# EAGLE schematic DC-DC Converter Module V2 (EAGLE 9.2.2)
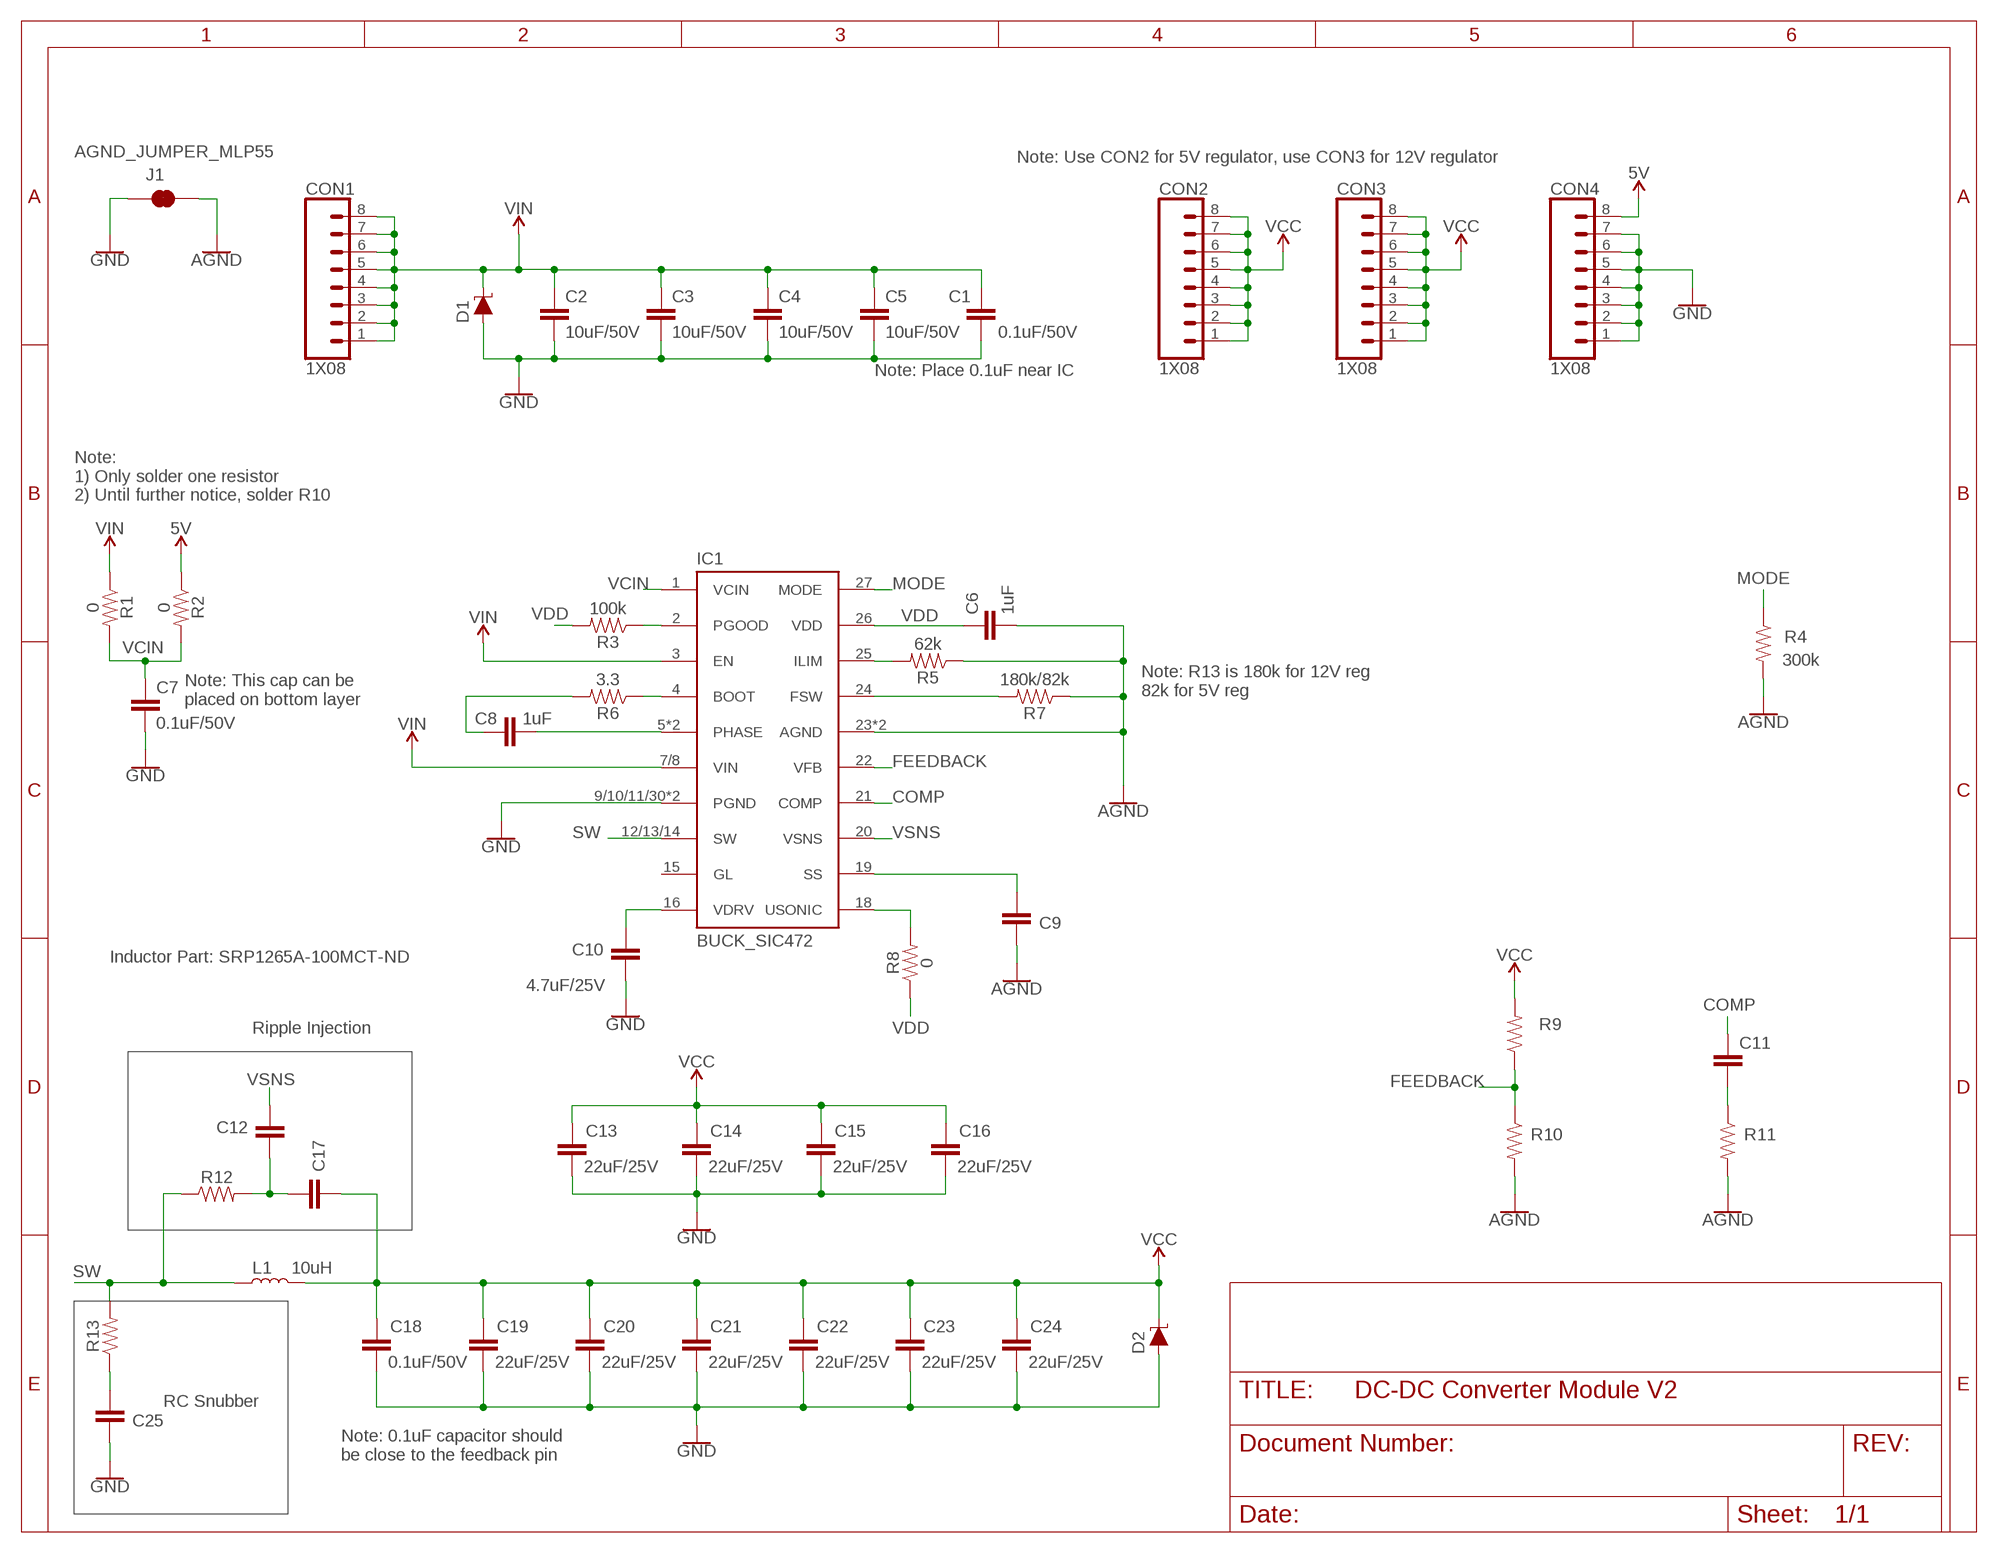
[diagram p0: schematic, sheet 1]

## Parts
C1  0.1uF/50V  CAPACITOR_0805  [0805]
C2  10uF/50V  CAPACITOR_1210  [1210]
C3  10uF/50V  CAPACITOR_1210  [1210]
C4  10uF/50V  CAPACITOR_1210  [1210]
C5  10uF/50V  CAPACITOR_1210  [1210]
C6  1uF  CAPACITOR_0805  [0805]
C7  0.1uF/50V  CAPACITOR_0805  [0805]
C8  1uF  CAPACITOR_0805  [0805]
C9  CAPACITOR_0805  [0805]
C10  4.7uF/25V  CAPACITOR_0805  [0805]
C11  CAPACITOR_0805  [0805]
C12  CAPACITOR_0805  [0805]
C13  22uF/25V  CAPACITOR_0805  [0805]
C14  22uF/25V  CAPACITOR_0805  [0805]
C15  22uF/25V  CAPACITOR_0805  [0805]
C16  22uF/25V  CAPACITOR_0805  [0805]
C17  CAPACITOR_0805  [0805]
C18  0.1uF/50V  CAPACITOR_0805  [0805]
C19  22uF/25V  CAPACITOR_0805  [0805]
C20  22uF/25V  CAPACITOR_0805  [0805]
C21  22uF/25V  CAPACITOR_0805  [0805]
C22  22uF/25V  CAPACITOR_0805  [0805]
C23  22uF/25V  CAPACITOR_0805  [0805]
C24  22uF/25V  CAPACITOR_0805  [0805]
C25  CAPACITOR_0805  [0805]
CON1  1X08  [1X08]
CON2  1X08  [1X08]
CON3  1X08  [1X08]
CON4  1X08  [1X08]
D1  DIODE_TVS_DO-214AA  [DO214AA]
D2  DIODE_TVS_DO-214AA  [DO214AA]
IC1  BUCK_SIC472  [MLP55-27L]
J1  AGND_JUMPER_MLP55  [AGND_JUMPER_MLP55]
L1  10uH  INDUCTOR_BOURNS_SRP1265A  [INDUCTOR_BOURNS_SRP1265A]
R1  0  RESISTOR_0805  [0805]
R2  0  RESISTOR_0805  [0805]
R3  100k  RESISTOR_0805  [0805]
R4  300k  RESISTOR_0805  [0805]
R5  62k  RESISTOR_0805  [0805]
R6  3.3  RESISTOR_0805  [0805]
R7  180k/82k  RESISTOR_0805  [0805]
R8  0  RESISTOR_0805  [0805]
R9  RESISTOR_0805  [0805]
R10  RESISTOR_0805  [0805]
R11  RESISTOR_0805  [0805]
R12  RESISTOR_0805  [0805]
R13  RESISTOR_0805  [0805]

## Nets
5V: CON4.8 R2.1
AGND: C6.2 C9.1 IC1.23(AGND) IC1.28(AGND) J1.P$2 R4.2 R5.1 R7.1 R10.2 R11.2
COMP: C11.2 IC1.21(COMP)
FEEDBACK: IC1.22(VFB) R9.1 R10.1
GND: C1.1 C2.2 C3.2 C4.2 C5.2 C7.2 C10.2 C13.1 C14.1 C15.1 C16.1 C18.1 C19.1 C20.1 C21.1 C22.1 C23.1 C24.1 C25.1 CON4.1 CON4.2 CON4.3 CON4.4 CON4.5 CON4.6 CON4.7 D1.A D2.A IC1.9/10/11/30(PGND) IC1.17(PGND) J1.P$1
MODE: IC1.27(MODE) R4.1
N$1: IC1.2(PGOOD) R3.1
N$4: C11.1 R11.1
N$5: C10.1 IC1.16(VDRV)
N$6: IC1.18(USONIC) R8.2
N$7: IC1.4(BOOT) R6.1
N$8: C8.2 IC1.5(PHASE) IC1.6(PHASE)
N$9: C8.1 R6.2
N$10: C9.2 IC1.19(SS)
N$11: IC1.24(FSW) R7.2
N$15: IC1.25(ILIM) R5.2
N$16: C25.2 R13.1
N$19: C12.2 C17.2 R12.2
SW: IC1.12/13/14(SW) L1.1 R12.1 R13.2
VCC: C13.2 C14.2 C15.2 C16.2 C17.1 C18.2 C19.2 C20.2 C21.2 C22.2 C23.2 C24.2 CON2.1 CON2.2 CON2.3 CON2.4 CON2.5 CON2.6 CON2.7 CON2.8 CON3.1 CON3.2 CON3.3 CON3.4 CON3.5 CON3.6 CON3.7 CON3.8 D2.C L1.2 R9.2
VCIN: C7.1 IC1.1(VCIN) R1.2 R2.2
VDD: C6.1 IC1.26(VDD) R3.2 R8.1
VIN: C1.2 C2.1 C3.1 C4.1 C5.1 CON1.1 CON1.2 CON1.3 CON1.4 CON1.5 CON1.6 CON1.7 CON1.8 D1.C IC1.3(EN) IC1.7/8(VIN) R1.1
VSNS: C12.1 IC1.20(VSNS)
Unconnected: IC1.15(GL)

## Notes on the sheet
- Note: Use CON2 for 5V regulator, use CON3 for 12V regulator
- Note: Place 0.1uF near IC
- Note: 
  1) Only solder one resistor
  2) Until further notice, solder R10
- Note: R13 is 180k for 12V reg
  82k for 5V reg
- Note: This cap can be
  placed on bottom layer
- Inductor Part: SRP1265A-100MCT-ND
- Ripple Injection
- RC Snubber
- Note: 0.1uF capacitor should 
  be close to the feedback pin

## Library data of the parts
C1 C6-C25 = EcoCar-Passives:CAPACITOR_0805
C2-C5 = EcoCar-Passives:CAPACITOR_1210
CON1-CON4 = EcoCar-Connectors-2.54mm:1X08: 2.54mm (0.1") Header
D1 D2 = EcoCar-Fuses-Protection:DIODE_TVS_DO-214AA
IC1 = EcoCar-Integrated-Circuits:BUCK_SIC472: 8A Out, 55V IN Buck Converter Manufacturer: Vishay Siliconix Part Number: SIC472ED-T1-GE3 Digikey Part Number: SIC472ED-T1-GE3CT-ND
J1 = EcoCar-Miscellaneous:AGND_JUMPER_MLP55
L1 = EcoCar-Passives:INDUCTOR_BOURNS_SRP1265A
R1-R13 = EcoCar-Passives:RESISTOR_0805